# EAGLE design rtu03 (EAGLE 9.6.0)
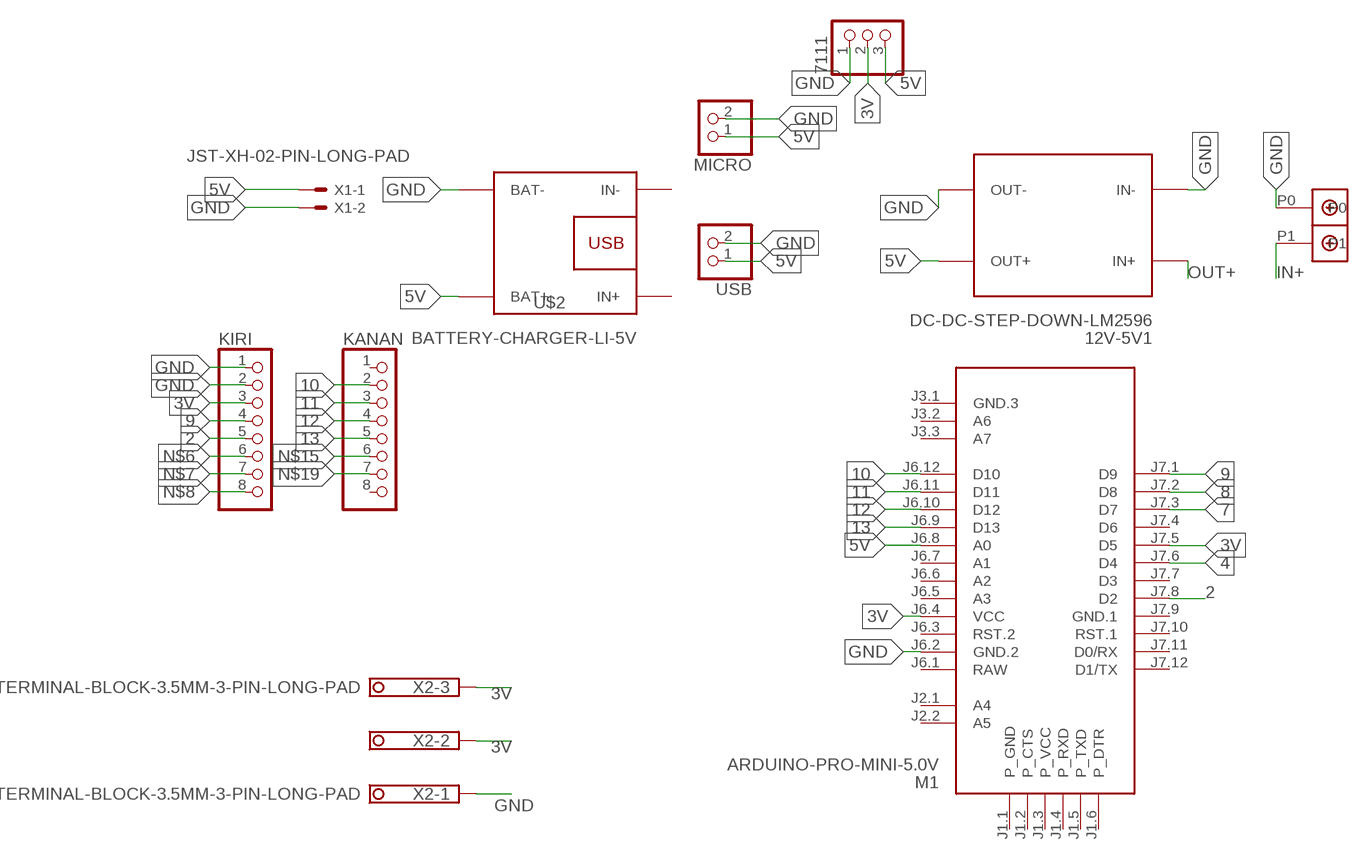
[diagram p0: schematic, sheet 1]

## Parts
12V-5V1  DC-DC-STEP-DOWN-LM2596  [DC-DC-STEP-DOWN-LM2596]
7111  PINHD-1X3  [1X03]
KANAN  PINHD-1X8  [1X08]
KIRI  PINHD-1X8  [1X08]
M1  ARDUINO-PRO-MINI-5.0V  [ARDUINO-PRO-MINI]
MICRO  PINHD-1X2  [1X02]
U$1  DBCONN-1X2  [DBCONN-1X2]
U$2  BATTERY-CHARGER-LI-5V  [BATTERY-CHARGER-LI-5V]
USB  PINHD-1X2  [1X02]
X1  JST-XH-02-PIN-LONG-PAD  [JST-XH-02-PACKAGE-LONG-PAD]
X2  TERMINAL-BLOCK-3.5MM-3-PIN-LONG-PAD  [TERMINAL-BLOCK-3-PIN-3.5MM-LONG-PAD]

## Nets
2: KIRI.5 M1.J7.8(D2)
3V: 7111.2 KIRI.3 M1.J6.4(VCC) M1.J7.5(D5) X2.2 X2.3
4: M1.J7.6(D4)
5V: 12V-5V1.OUT+ 7111.3 M1.J6.8(A0) MICRO.1 U$2.BAT+ USB.1 X1.1
7: M1.J7.3(D7)
8: M1.J7.2(D8)
9: KIRI.4 M1.J7.1(D9)
10: KANAN.2 M1.J6.12(D10)
11: KANAN.3 M1.J6.11(D11)
12: KANAN.4 M1.J6.10(D12)
13: KANAN.5 M1.J6.9(D13)
GND: 12V-5V1.IN- 12V-5V1.OUT- 7111.1 KIRI.1 KIRI.2 M1.J6.2(GND.2) MICRO.2 U$1.P0 U$2.BAT- USB.2 X1.2 X2.1
IN+: U$1.P1
N$6: KIRI.6
N$7: KIRI.7
N$8: KIRI.8
N$15: KANAN.6
N$19: KANAN.7
OUT+: 12V-5V1.IN+
Unconnected: KANAN.1 KANAN.8 M1.J1.1(P_GND) M1.J1.2(P_CTS) M1.J1.3(P_VCC) M1.J1.4(P_RXD) M1.J1.5(P_TXD) M1.J1.6(P_DTR) M1.J2.1(A4) M1.J2.2(A5) M1.J3.1(GND.3) M1.J3.2(A6) M1.J3.3(A7) M1.J6.3(RST.2) M1.J6.5(A3) M1.J6.6(A2) M1.J6.7(A1) M1.J7.4(D6) M1.J7.7(D3) M1.J7.10(RST.1) M1.J7.11(D0/RX) M1.J7.12(D1/TX) U$2.IN+ U$2.IN-

## Power pins joined to a net without a drawn wire
GND.1: M1.J7.9(GND.1)
RAW: M1.J6.1(RAW)

## Library data of the parts
12V-5V1 = diy-modules:DC-DC-STEP-DOWN-LM2596: DC/DC Step-Down Regulator based on LM2596-ADJ chip LM2596 datasheet available here: http://www.ti.com/lit/ds/symlink/lm2596.pdf Click here to find device on ebay.com <http://www.ebay.com/sch/lm2596+power+regulator>
7111 = pinhead:PINHD-1X3: PIN HEADER
KANAN KIRI = pinhead:PINHD-1X8: PIN HEADER
M1 = diy-modules:ARDUINO-PRO-MINI-*: Arduino Pro Mini and compatible devices More details available here: https://www.arduino.cc/en/Main/ArduinoBoardProMini Click here to find device on ebay.com <http://www.ebay.com/sch/arduino+pro+mini>
MICRO USB = pinhead:PINHD-1X2: PIN HEADER
U$1 = Terminal Block Connector:DBCONN-1X2
U$2 = diy-modules (1):BATTERY-CHARGER-LI-5V: Lithium Battery 5V Charger More details available here: http://www.buildcircuit.com/how-to-use-micro-usb-5v-1a-lithium-battery-charging-board-charger-module/ Click here to find device on ebay.com <http://www.ebay.com/sch/tp4056+charger+usb>
X1 = Rembrandt Electronics - JST XH Connectors v1-0:JST-XH-02-PIN: JST XH Connector 2 Pin Wire to board connector. Pitch: 2,54 mm, (0.100") Number of pins: 2 Created by Rembrandt Electronics www.rembrandtelectronics.com
X2 = Rembrandt Electronics - Terminal Block 3-5mm v1-0:TERMINAL-BLOCK-3.5MM-3-PIN: Terminal Block 3.5mm Pitch: 3,5 mm Number of pins: 3 Created by Rembrandt Electronics www.rembrandtelectronics.com

## Board
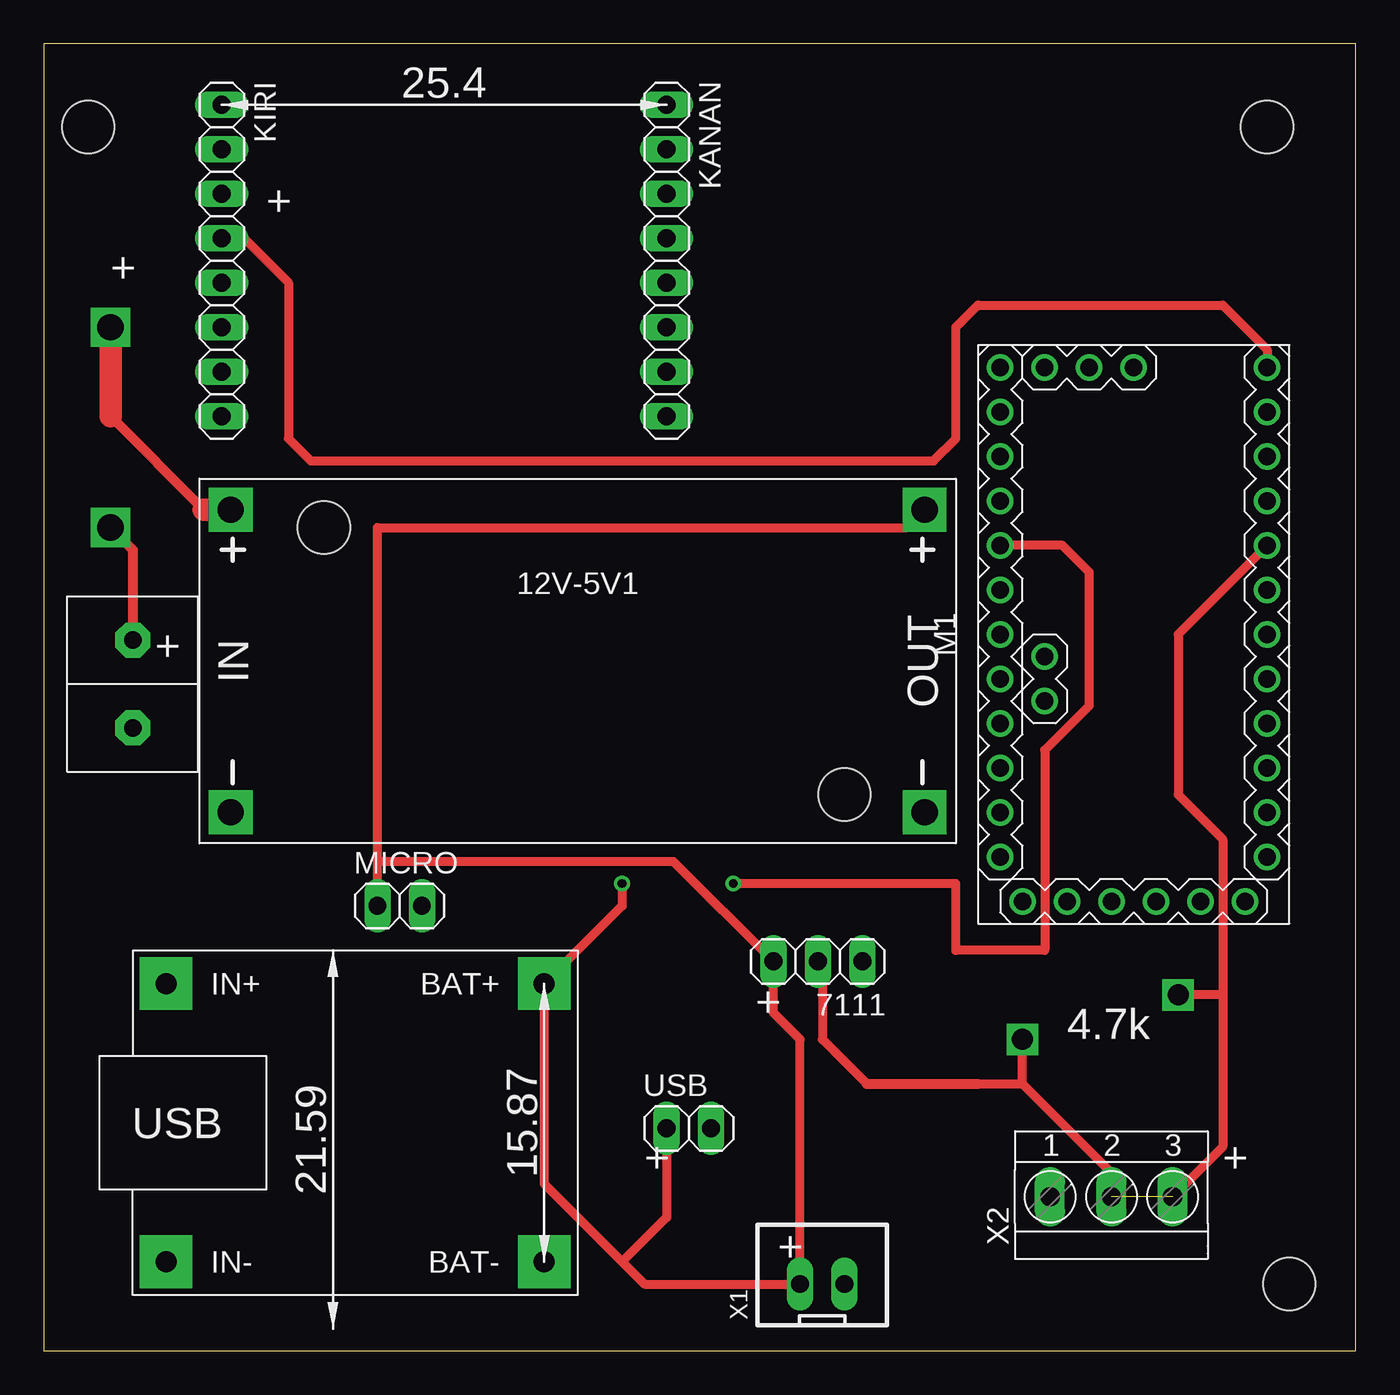
[diagram p1: board, top side]
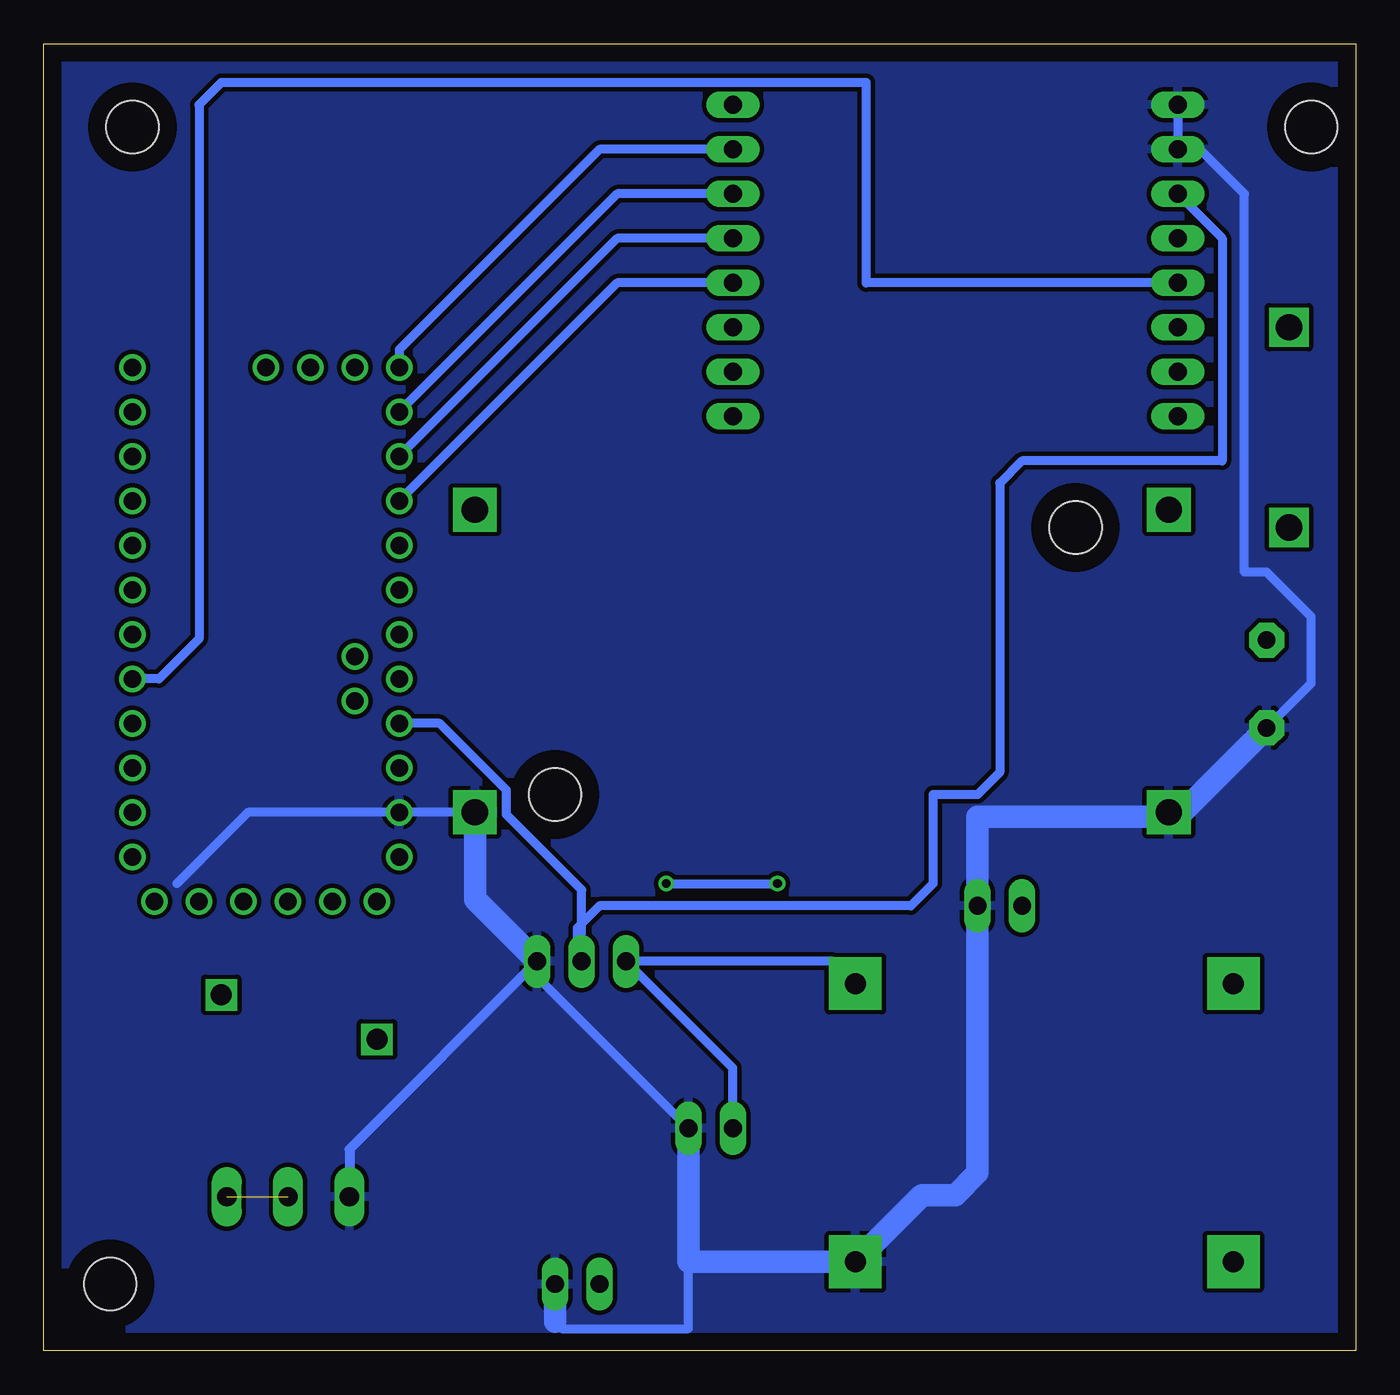
[diagram p2: board, bottom side, seen from below]

Size 74.91 x 74.6 mm. Coordinates in mm from the lower left corner, seen from the top.
Outline: 0,0 74.91,0 74.91,74.6 0,74.6 0,0
Copper layers (1*16): Top 0.035mm / dielectric 1.5mm / Bottom 0.035mm
Design rules "default": minimum track width 6mil, minimum drill 0.35mm, track to track 6mil, track to pad 6mil, pad to pad 6mil, via to via 6mil, smd to smd 6mil, copper to edge 40mil, drill to drill 6mil, minimum pad ring 10mil, minimum via ring 8mil, stop-mask expansion 4mil, vias tented up to drill 0mil, thermal gap 10mil
Holes 3 mm at 69.85,69.85 71.12,3.81 2.54,69.85

### Footprints (pad centres in the part's own frame; a part is rotated, then mirrored left to right if it is on the bottom)
DC-DC-STEP-DOWN-LM2596 = drill 1.5 pad 2.5 square: IN+ -19.812,8.636; IN- -19.812,-8.636; OUT+ 19.812,8.636; OUT- 19.812,-8.636 | hole 3: -14.478,7.62; 15.24,-7.62
1X03 = drill 1.016 long: 1 -2.54,0; 2 0,0; 3 2.54,0
1X08 = drill 1.016 long: 1 -8.89,0; 2 -6.35,0; 3 -3.81,0; 4 -1.27,0; 5 1.27,0; 6 3.81,0; 7 6.35,0; 8 8.89,0
ARDUINO-PRO-MINI = drill 1: J1.1 -15.24,6.35; J1.2 -15.24,3.81; J1.3 -15.24,1.27; J1.4 -15.24,-1.27; J1.5 -15.24,-3.81; J1.6 -15.24,-6.35; J2.1 -1.27,5.08; J2.2 -3.81,5.08; J3.1 15.24,0; J3.2 15.24,2.54; J3.3 15.24,5.08; J6.1 -12.7,7.62; J6.2 -10.16,7.62; J6.3 -7.62,7.62; J6.4 -5.08,7.62; J6.5 -2.54,7.62; J6.6 0,7.62; J6.7 2.54,7.62; J6.8 5.08,7.62; J6.9 7.62,7.62; J6.10 10.16,7.62; J6.11 12.7,7.62; J6.12 15.24,7.62; J7.1 15.24,-7.62; J7.2 12.7,-7.62; J7.3 10.16,-7.62; J7.4 7.62,-7.62; J7.5 5.08,-7.62; J7.6 2.54,-7.62; J7.7 0,-7.62; J7.8 -2.54,-7.62; J7.9 -5.08,-7.62; J7.10 -7.62,-7.62; J7.11 -10.16,-7.62; J7.12 -12.7,-7.62
1X02 = drill 1.016 long: 1 -1.27,0; 2 1.27,0
DBCONN-1X2 = drill 1 pad 2 octagon: P0 -2.54,0; P1 2.46,0
BATTERY-CHARGER-LI-5V = drill 1.2 pad 3 square: BAT+ 10.795,8.255; BAT- 10.795,-7.62; IN+ -10.795,8.255; IN- -10.795,-7.62
JST-XH-02-PACKAGE-LONG-PAD = drill 1.016 long: 1 -1.27,0; 2 1.27,0
TERMINAL-BLOCK-3-PIN-3.5MM-LONG-PAD = drill 1.1 pad 1.7 long: 1 -3.5,-0.1; 2 0,-0.1; 3 3.5,-0.1

### Placement (x,y rotation side)
12V-5V1  30.48,39.37 0 top
7111  44.2,22.23 180 top
KANAN  35.56,62.23 270 top
KIRI  10.16,62.23 270 top
M1  62.23,40.89 90 top
MICRO  20.32,25.4 0 top
U$1  5.08,38.1 90 top
U$2  17.78,12.7 0 top
USB  36.83,12.7 0 top
X1  44.45,3.81 0 top
X2  60.96,8.89 0 top

### Tracks (layer width: path | path; a pad name or v marks a point on that pad's centre or on a via)
2
  Bottom 0.508: 69.6,38.1 M1.J7.8 68.33,38.35 66.04,40.64 66.04,71.12 64.77,72.39 27.94,72.39 27.94,60.96 KIRI.5
3V  (via drill 1.2 pad 1.3)  (1 unrouted)
  Top 0.508: 7111.2 44.45,21.97 44.45,17.78 46.99,15.24 | M1.J7.5 64.77,40.89 64.77,31.75 67.31,29.21 67.31,20.32 | 53.34,15.24 55.88,15.24 | X2.2 60.96,10.16 55.88,15.24 | 64.67,8.99 67.31,11.64 67.31,20.32 | 67.31,20.32 v64.77,20.32 | 55.88,15.24 v55.88,17.78
  Top 0.58: 46.99,15.24 53.34,15.24 | X2.3 64.67,8.99 64.77,9.1
  Bottom 0.508: KIRI.3 7.62,63.5 7.62,50.8 19.05,50.8 20.32,49.53 20.32,33.02 21.59,31.75 24.13,31.75 24.13,26.67 25.4,25.4 43.18,25.4 44.45,24.13 44.45,22.48 7111.2 44.2,26.31 48.49,30.6 48.49,32.01 52.3,35.81 M1.J6.4
5V  (via drill 0.5)
  Top 0.508: 12V-5V1.OUT+ 49.28,46.99 19.05,46.99 MICRO.1 19.05,27.94 35.94,27.94 7111.3 41.66,19.3 43.18,17.78 X1.1 34.29,3.81 33.02,5.08 | M1.J6.8 58.17,45.97 59.69,44.45 59.69,36.83 57.15,34.29 57.15,22.86 52.07,22.86 52.07,26.67 v39.37,26.67 | 33.02,5.08 28.57,9.53 U$2.BAT+ 33.02,25.4 v33.02,26.67 | USB.1 35.56,7.62 33.02,5.08
  Bottom 0.508: USB.1 35.56,16.13 7111.3 29.84,22.23 U$2.BAT+ | v39.37,26.67 v33.02,26.67
9
  Top 0.508: KIRI.4 11.43,63.5 13.97,60.96 13.97,52.07 15.24,50.8 50.8,50.8 52.07,52.07 52.07,58.42 53.34,59.69 67.31,59.69 69.85,57.15 M1.J7.1
10
  Bottom 0.508: KANAN.2 43.18,68.58 54.61,57.15 M1.J6.12
11
  Bottom 0.508: KANAN.3 42.16,66.04 M1.J6.11
12
  Bottom 0.508: M1.J6.10 42.16,63.5 KANAN.4
13
  Bottom 0.508: M1.J6.9 42.16,60.96 KANAN.5
GND
  Bottom 0.508: 45.72,1.65 45.34,1.27 38.1,1.27 38.1,5.08 | 12V-5V1.OUT- M1.J6.2 63.25,30.73 67.31,26.67 | KIRI.1 KIRI.2 8.89,68.58 6.35,66.04 6.35,44.45 5.08,44.45 2.54,41.91 2.54,38.1 U$1.P0 | USB.2 46.74,21.34 7111.1
  Bottom 0.58: 7111.1 57.46,11.5 X2.1
  Bottom 1.27: U$1.P0 9.91,30.73 12V-5V1.IN- 10.92,30.48 21.59,30.48 MICRO.2 21.59,10.16 22.86,8.89 24.77,8.89 U$2.BAT- 38.1,5.08 USB.2 | 7111.1 50.29,25.78 12V-5V1.OUT- | X1.2 45.72,1.65
  pour Bottom (isolate 0.254): 0,74.93 74.93,74.93 74.93,0 0,0
IN+  (via drill 1.5)
  Top 0.58: U$1.P1 5.08,45.72 v3.81,46.99
OUT+  (via drill 1.5)
  Top 0.58: 9.14,48.01 3.81,53.34
  Top 1.27: 12V-5V1.IN+ 9.14,48.01 | 3.81,53.34 v3.81,58.42

### Text on the board
tPlace: + | + | + | + | 4.7k | + | + | +